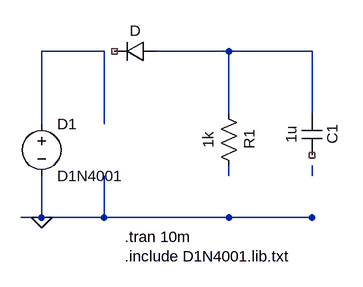
[diagram p0: schematic Lab04_DetectorPico.asc]
Lab04_DetectorPico.asc, the LTspice schematic file:
Version 4
SHEET 1 880 680
WIRE 128 64 32 64
WIRE 320 64 208 64
WIRE 320 160 320 64
WIRE 448 64 320 64
WIRE 448 160 448 64
WIRE 32 176 32 64
WIRE 128 176 128 64
WIRE 320 256 320 240
WIRE 448 256 448 240
WIRE 32 320 32 256
WIRE 128 320 128 256
WIRE 320 320 320 320
WIRE 448 320 448 320
WIRE 32 320 0 320
WIRE 128 320 32 320
WIRE 320 320 128 320
WIRE 448 320 320 320
FLAG 32 320 0
SYMBOL diode 208 48 R90
WINDOW 0 32 32 VTop 2
WINDOW 3 0 32 VBottom 2
SYMBOL res 304 144 R0
WINDOW 0 32 56 VTop 2
WINDOW 3 0 56 VBottom 2
SYMATTR InstName R1
SYMATTR Value 1k
SYMBOL cap 432 160 R0
WINDOW 0 32 32 VTop 2
WINDOW 3 0 32 VBottom 2
SYMATTR InstName C1
SYMATTR Value 1u
SYMBOL voltage 32 160 R0
WINDOW 123 0 0 Left 2
WINDOW 39 0 0 Left 2
SYMATTR InstName V1
SYMATTR Value SINE(0 10 1k)
TEXT 160 350 Left 2 !.tran 10m
TEXT 160 380 Left 2 !.include D1N4001.lib.txt
SYMATTR InstName D1
SYMATTR Value D1N4001

The netlist it stands for:
* Lab04_DetectorPico.asc
D§? N002 NC_01 D
R1 N002 N003 1k
C1 N002 NC_02 1u
V§D1 N001 0 D1N4001
.model D D
.lib standard.dio
.tran 10m
.include D1N4001.lib.txt
.backanno
.end